# Altium schematic sheet OSV-UserInterface.SchDoc
size A3
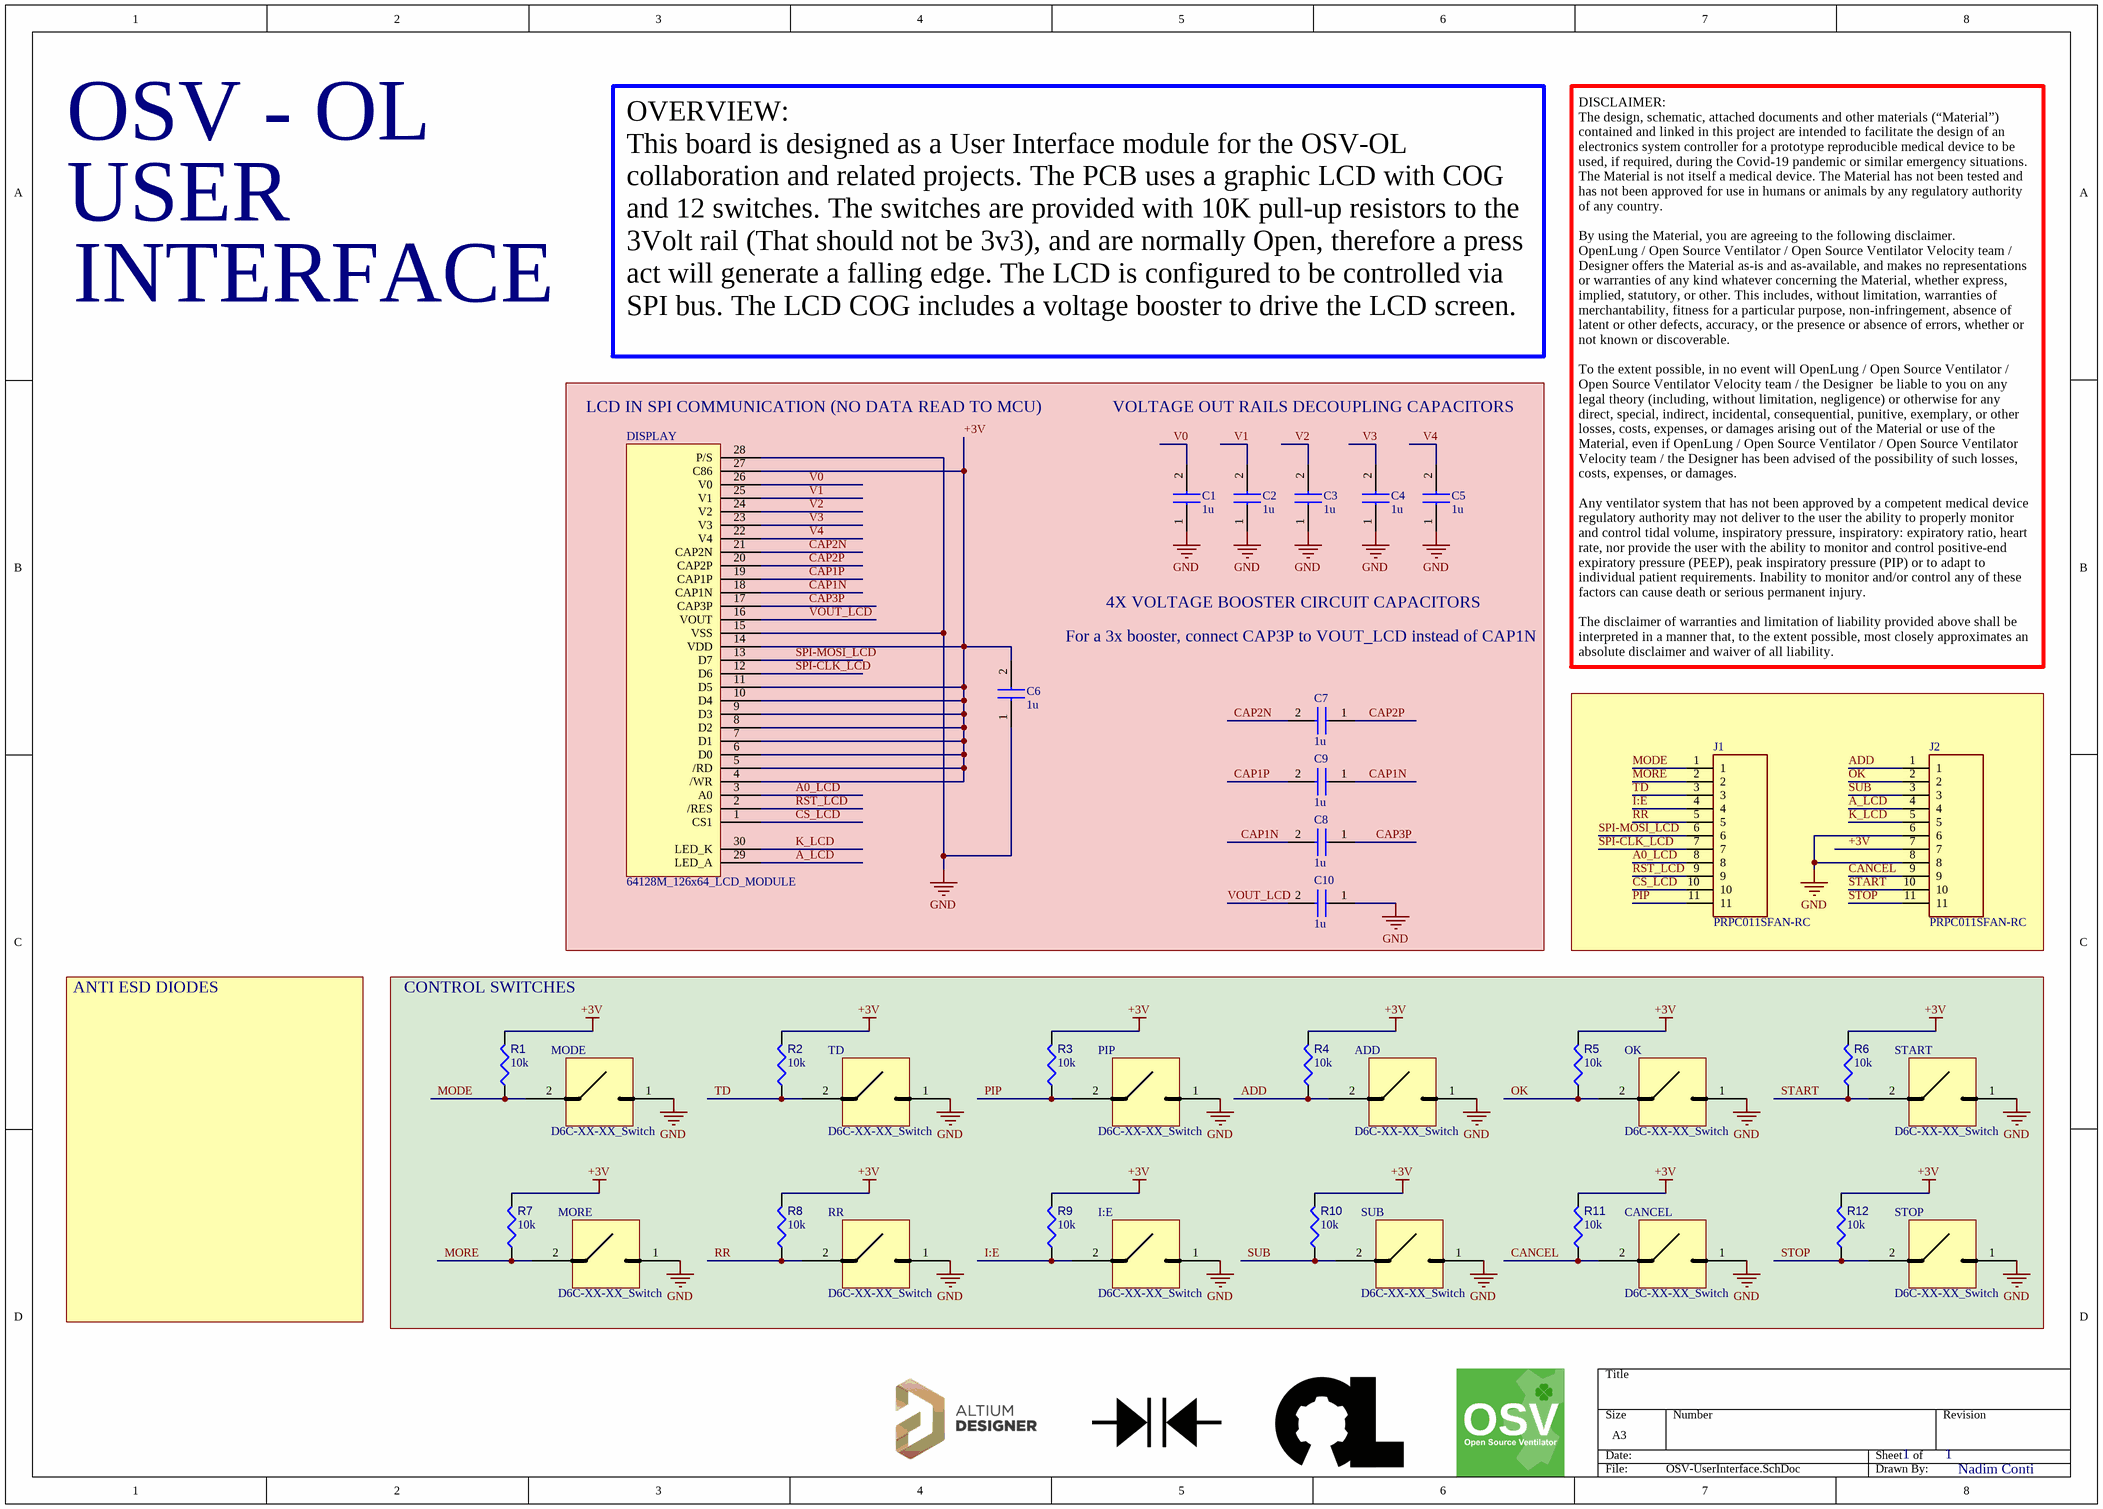
[diagram p0: OSV-UserInterface.SchDoc]

## Parts
ADD  D6C-XX-XX_Switch  [D6C-60-F1_Blue-Switch]
C1  Capacitance: 1u  [CAPC2012X140N]  (hidden comment: GCM21BR71H105KA03K)
C2  Capacitance: 1u  [CAPC2012X140N]  (hidden comment: GCM21BR71H105KA03K)
C3  Capacitance: 1u  [CAPC2012X140N]  (hidden comment: GCM21BR71H105KA03K)
C4  Capacitance: 1u  [CAPC2012X140N]  (hidden comment: GCM21BR71H105KA03K)
C5  Capacitance: 1u  [CAPC2012X140N]  (hidden comment: GCM21BR71H105KA03K)
C6  Capacitance: 1u  [CAPC2012X140N]  (hidden comment: GCM21BR71H105KA03K)
C7  Capacitance: 1u  [CAPC2012X140N]  (hidden comment: GCM21BR71H105KA03K)
C8  Capacitance: 1u  [CAPC2012X140N]  (hidden comment: GCM21BR71H105KA03K)
C9  Capacitance: 1u  [CAPC2012X140N]  (hidden comment: GCM21BR71H105KA03K)
C10  Capacitance: 1u  [CAPC2012X140N]  (hidden comment: GCM21BR71H105KA03K)
CANCEL  D6C-XX-XX_Switch  [D6C-30-F1_YELLOW-SWITCH]
DISPLAY  64128M_126x64_LCD_MODULE  [64128M_LCD]
I:E  D6C-XX-XX_Switch  [D6C-00-F1_White-Switch]
J1  PRPC011SFAN-RC  [HDRV11W64P254_1X11_2794X254X1058P]
J2  PRPC011SFAN-RC  [HDRV11W64P254_1X11_2794X254X1058P]
MODE  D6C-XX-XX_Switch  [D6C-30-F1_YELLOW-SWITCH]
MORE  D6C-XX-XX_Switch  [D6C-00-F1_White-Switch]
OK  D6C-XX-XX_Switch  [D6C-50-F1_GREEN-Switch]
PIP  D6C-XX-XX_Switch  [D6C-00-F1_White-Switch]
R1  value 10k  [RESC2013X50X35ML15T15]  (hidden comment: Resistor 10k +/-1% 0805 125 mW)
R2  value 10k  [RESC2013X50X35ML15T15]  (hidden comment: Resistor 10k +/-1% 0805 125 mW)
R3  value 10k  [RESC2013X50X35ML15T15]  (hidden comment: Resistor 10k +/-1% 0805 125 mW)
R4  value 10k  [RESC2013X50X35ML15T15]  (hidden comment: Resistor 10k +/-1% 0805 125 mW)
R5  value 10k  [RESC2013X50X35ML15T15]  (hidden comment: Resistor 10k +/-1% 0805 125 mW)
R6  value 10k  [RESC2013X50X35ML15T15]  (hidden comment: Resistor 10k +/-1% 0805 125 mW)
R7  value 10k  [RESC2013X50X35ML15T15]  (hidden comment: Resistor 10k +/-1% 0805 125 mW)
R8  value 10k  [RESC2013X50X35ML15T15]  (hidden comment: Resistor 10k +/-1% 0805 125 mW)
R9  value 10k  [RESC2013X50X35ML15T15]  (hidden comment: Resistor 10k +/-1% 0805 125 mW)
R10  value 10k  [RESC2013X50X35ML15T15]  (hidden comment: Resistor 10k +/-1% 0805 125 mW)
R11  value 10k  [RESC2013X50X35ML15T15]  (hidden comment: Resistor 10k +/-1% 0805 125 mW)
R12  value 10k  [RESC2013X50X35ML15T15]  (hidden comment: Resistor 10k +/-1% 0805 125 mW)
RR  D6C-XX-XX_Switch  [D6C-00-F1_White-Switch]
START  D6C-XX-XX_Switch  [D6C-50-F1_GREEN-Switch]
STOP  D6C-XX-XX_Switch  [D6C-40-F1_RED-SWITCH]
SUB  D6C-XX-XX_Switch  [D6C-60-F1_Blue-Switch]
TD  D6C-XX-XX_Switch  [D6C-00-F1_White-Switch]

## Blocks framed on the sheet
CONTROL SWITCHES: ADD CANCEL I:E MODE MORE OK PIP R1-R12 RR START STOP SUB TD

## Nets
+3V: C6.2 DISPLAY.4(/WR) DISPLAY.5(/RD) DISPLAY.6(D0) DISPLAY.7(D1) DISPLAY.8(D2) DISPLAY.9(D3) DISPLAY.10(D4) DISPLAY.11(D5) DISPLAY.14(VDD) DISPLAY.27(C86) J2.7 R1.2 R2.2 R3.2 R4.2 R5.2 R6.2 R7.2 R8.2 R9.2 R10.2 R11.2 R12.2
GND: ADD.1 C1.1 C2.1 C3.1 C4.1 C5.1 C6.1 C10.1 CANCEL.1 DISPLAY.15(VSS) DISPLAY.28(P/S) I:E.1 J2.6 J2.8 MODE.1 MORE.1 OK.1 PIP.1 RR.1 START.1 STOP.1 SUB.1 TD.1
A0_LCD: DISPLAY.3(A0) J1.8
A_LCD: DISPLAY.29(LED_A) J2.4
ADD: ADD.2 J2.1 R4.1
CANCEL: CANCEL.2 J2.9 R11.1
CAP1N: C8.2 C9.1 DISPLAY.18(CAP1N)
CAP1P: C9.2 DISPLAY.19(CAP1P)
CAP2N: C7.2 DISPLAY.21(CAP2N)
CAP2P: C7.1 DISPLAY.20(CAP2P)
CAP3P: C8.1 DISPLAY.17(CAP3P)
CS_LCD: DISPLAY.1(CS1) J1.10
I:E: I:E.2 J1.4 R9.1
K_LCD: DISPLAY.30(LED_K) J2.5
MODE: J1.1 MODE.2 R1.1
MORE: J1.2 MORE.2 R7.1
OK: J2.2 OK.2 R5.1
PIP: J1.11 PIP.2 R3.1
RR: J1.5 R8.1 RR.2
RST_LCD: DISPLAY.2(/RES) J1.9
SPI-CLK_LCD: DISPLAY.12(D6) J1.7
SPI-MOSI_LCD: DISPLAY.13(D7) J1.6
START: J2.10 R6.1 START.2
STOP: J2.11 R12.1 STOP.2
SUB: J2.3 R10.1 SUB.2
TD: J1.3 R2.1 TD.2
V0: C1.2 DISPLAY.26(V0)
V1: C2.2 DISPLAY.25(V1)
V2: C3.2 DISPLAY.24(V2)
V3: C4.2 DISPLAY.23(V3)
V4: C5.2 DISPLAY.22(V4)
VOUT_LCD: C10.2 DISPLAY.16(VOUT)

## Notes on the sheet
- OSV - OL
- USER
- INTERFACE
- OVERVIEW:
  This board is designed as a User Interface module for the OSV-OL collaboration and related projects. The PCB uses a graphic LCD with COG and 12 switches. The switches are provided with 10K pull-up resistors to the 3Volt rail (That should not be 3v3), and are normally Open, therefore a press act will generate a falling edge. The LCD is configured to be controlled via SPI bus. The LCD COG includes a voltage booster to drive the LCD screen.
- (near DISPLAY) LCD IN SPI COMMUNICATION (NO DATA READ TO MCU)
- VOLTAGE OUT RAILS DECOUPLING CAPACITORS
- For a 3x booster, connect CAP3P to VOUT_LCD instead of CAP1N
- 4X VOLTAGE BOOSTER CIRCUIT CAPACITORS
- DISCLAIMER:
  The design, schematic, attached documents and other materials (“Material”) contained and linked in this project are intended to facilitate the design of an electronics system controller for a prototype reproducible medical device to be used, if required, during the Covid-19 pandemic or similar emergency situations. The Material is not itself a medical device. The Material has not been tested and has not been approved for use in humans or animals by any regulatory authority of any country.
  By using the Material, you are agreeing to the following disclaimer.
  OpenLung / Open Source Ventilator / Open Source Ventilator Velocity team / Designer offers the Material as-is and as-available, and makes no representations or warranties of any kind whatever concerning the Material, whether express, implied, statutory, or other. This includes, without limitation, warranties of merchantability, fitness for a particular purpose, non-infringement, absence of latent or other defects, accuracy, or the presence or absence of errors, whether or not known or discoverable.
  To the extent possible, in no event will OpenLung / Open Source Ventilator / Open Source Ventilator Velocity team / the Designer  be liable to you on any legal theory (including, without limitation, negligence) or otherwise for any direct, special, indirect, incidental, consequential, punitive, exemplary, or other losses, costs, expenses, or damages arising out of the Material or use of the Material, even if OpenLung / Open Source Ventilator / Open Source Ventilator Velocity team / the Designer has been advised of the possibility of such losses, costs, expenses, or damages.
  Any ventilator system that has not been approved by a competent medical device regulatory authority may not deliver to the user the ability to properly monitor and control tidal volume, inspiratory pressure, inspiratory: expiratory ratio, heart rate, nor provide the user with the ability to monitor and control positive-end expiratory pressure (PEEP), peak inspiratory pressure (PIP) or to adapt to individual patient requirements. Inability to monitor and/or control any of these factors can cause death or serious permanent injury.
  The disclaimer of warranties and limitation of liability provided above shall be interpreted in a manner that, to the extent possible, most closely approximates an absolute disclaimer and waiver of all liability.
- ANTI ESD DIODES
- 1          1
- Nadim Conti

## Library data of the parts
C1-C10 = GCM21BR71H105KA03K: Capacitor; Manufacturer_Name: Murata Electronics; Datasheet Link: https://psearch.en.murata.com/capacitor/product/GCM21BR71H105KA03%23.html; Height: 1.4mm; Manufacturer_Part_Number: GCM21BR71H105KA03K; Mouser Part Number: 81-GCM21BR71H105KA3K; Mouser Price/Stock: https://www.mouser.com/Search/Refine.aspx?Keyword=81-GCM21BR71H105KA3K
DISPLAY = 64128M_126x64_LCD_MODULE: 64128M Series LCD Module (128 x 64 DOTS)
J1 J2 = PRPC011SFAN-RC: Connector; Manufacturer_Name: Sullins; Datasheet Link: https://media.digikey.com/PDF/Data%20Sheets/Sullins%20PDFs/xRxCzzzSxxN-RC_ST_11635-B.pdf; Height: 10.58mm; Manufacturer_Part_Number: PRPC011SFAN-RC
R1-R12 = CMP-009-00018-5: Chip Resistor, 10 KOhm, +/- 1%, 125 mW, -55 to 155 degC, 0805 (2012 Metric); Power: 125mW; Voltage Rating: 150V; Case/Package: 0805; Pins: 2; Min Operating Temperature: -55°C; Tolerance: 1%; RoHS Compliant: True; Mounting Technology: SM; Max Operating Temperature: 155°C